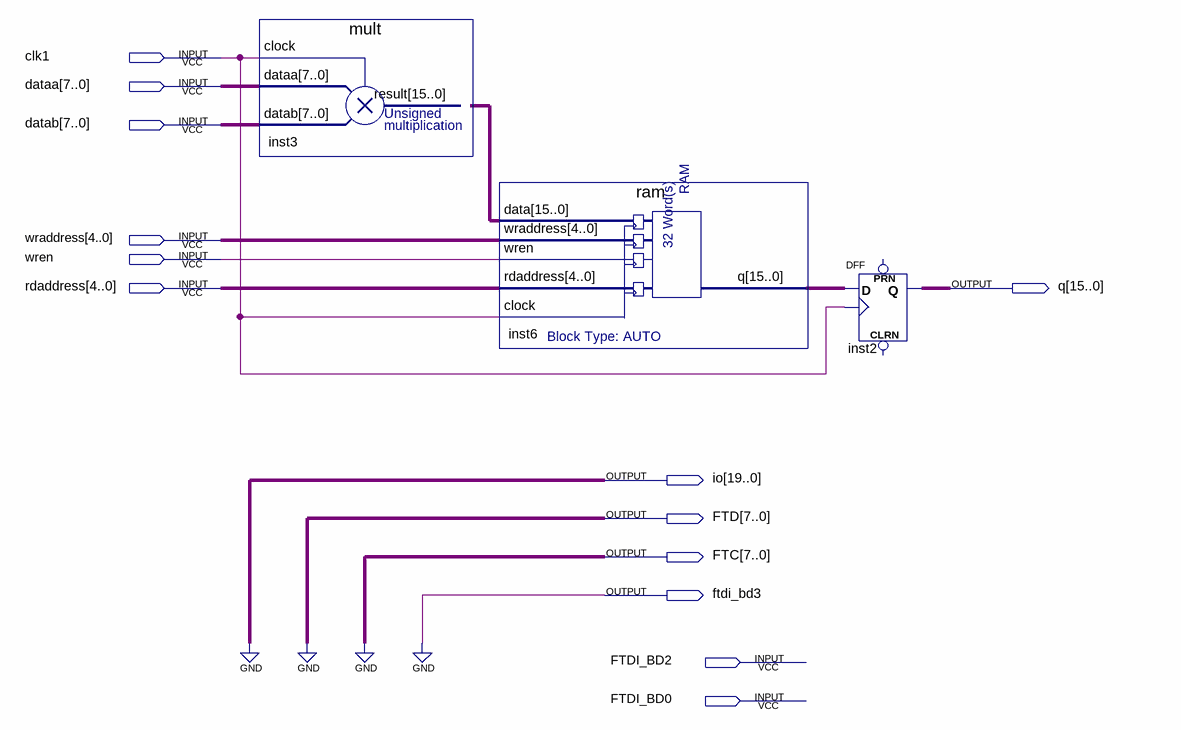
[diagram p0: schematic sheet]
// Quartus schematic pipemult.bdf as structural Verilog: 3 symbols, 13 pins
module pipemult (
  input  clk1,
  input  [7:0] dataa,
  input  [7:0] datab,
  input  [4:0] wraddress,
  input  wren,
  input  [4:0] rdaddress,
  input  FTDI_BD2,
  input  FTDI_BD0,
  output [15:0] q,
  output [19:0] io,
  output [7:0] FTD,
  output [7:0] FTC,
  output ftdi_bd3
);

  wire [15:0] inst3_result, inst6_q;

  mult inst3 (.clock(clk1), .dataa(dataa), .datab(datab), .result(inst3_result));
  ram inst6 (.data(inst3_result), .wraddress(wraddress), .wren(wren), .rdaddress(rdaddress), .clock(clk1), .q(inst6_q));
  DFF inst2[15:0] (.CLK(clk1), .D(inst6_q), .Q(q));  // open: CLRN, PRN

  assign FTC = {8{1'b0}};
  assign FTD = {8{1'b0}};
  assign ftdi_bd3 = 1'b0;
  assign io = {20{1'b0}};
endmodule
